# Altium schematic sheet Controls_Microcontroller.SchDoc
size Letter; SheetNumber: 12; SheetTotal: 13
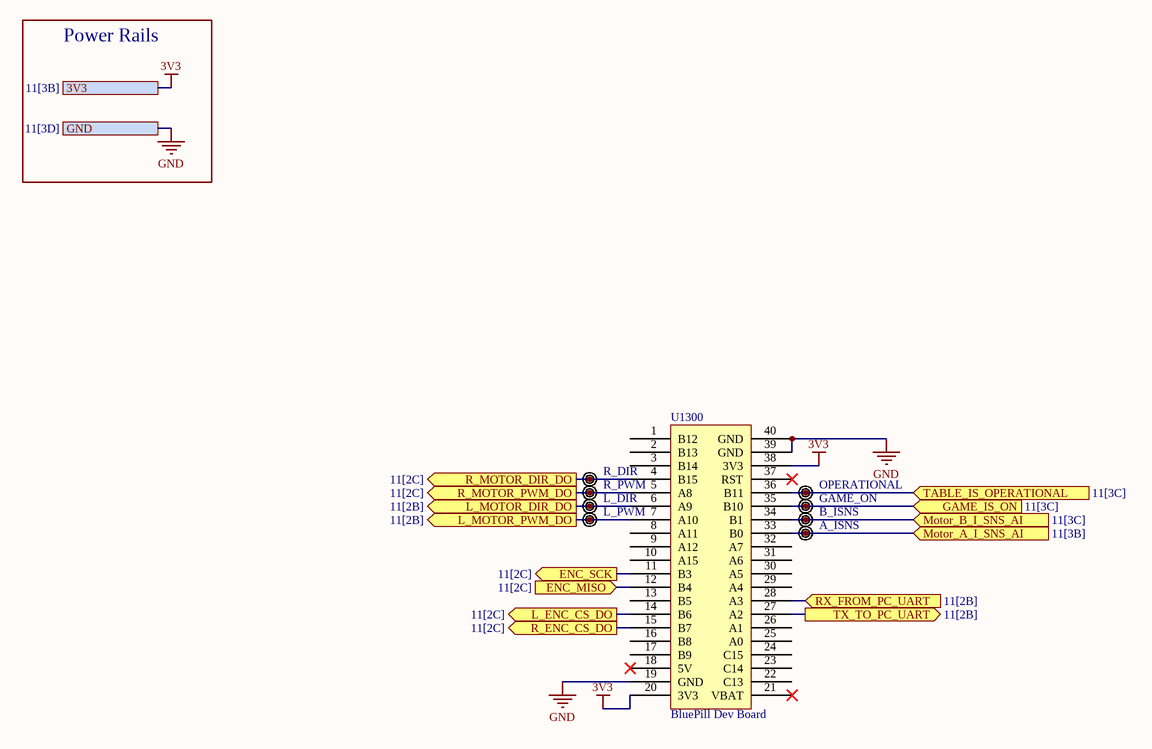
[diagram p0: Controls_Microcontroller.SchDoc]

## Parts
TP1300  R_DIR  [TESTPOINT]  (no BOM)
TP1301  R_PWM  [TESTPOINT]  (no BOM)
TP1302  OPERATIONAL  [TESTPOINT]  (no BOM)
TP1303  L_DIR  [TESTPOINT]  (no BOM)
TP1304  GAME_ON  [TESTPOINT]  (no BOM)
TP1305  L_PWM  [TESTPOINT]  (no BOM)
TP1306  B_ISNS  [TESTPOINT]  (no BOM)
TP1307  A_ISNS  [TESTPOINT]  (no BOM)
U1300  BluePill Dev Board  [Blue Pill]

## Ports
3V3 (see 11[3B]), ENC_MISO (in, see 11[2C]), ENC_SCK (out, see 11[2C]), GAME_IS_ON (in, see 11[3C]), GND (see 11[3D]), L_ENC_CS_DO (out, see 11[2C]), L_MOTOR_DIR_DO (out, see 11[2B]), L_MOTOR_PWM_DO (out, see 11[2B]), Motor_A_I_SNS_AI (in, see 11[3B]), Motor_B_I_SNS_AI (in, see 11[3C]), R_ENC_CS_DO (out, see 11[2C]), R_MOTOR_DIR_DO (out, see 11[2C]), R_MOTOR_PWM_DO (out, see 11[2C]), RX_FROM_PC_UART (in, see 11[2B]), TABLE_IS_OPERATIONAL (in, see 11[3C]), TX_TO_PC_UART (out, see 11[2B])

## Nets
3V3: U1300.20(3V3) U1300.38(3V3) ; port 3V3
GND: U1300.19(GND) U1300.39(GND) U1300.40(GND) ; port GND
ENC_MISO: U1300.12(B4) ; port ENC_MISO
ENC_SCK: U1300.11(B3) ; port ENC_SCK
GAME_IS_ON: TP1304.1(TP) U1300.35(B10) ; port GAME_IS_ON
L_ENC_CS_DO: U1300.14(B6) ; port L_ENC_CS_DO
L_MOTOR_DIR_DO: TP1303.1(TP) U1300.6(A9) ; port L_MOTOR_DIR_DO
L_MOTOR_PWM_DO: TP1305.1(TP) U1300.7(A10) ; port L_MOTOR_PWM_DO
Motor_A_I_SNS_AI: TP1307.1(TP) U1300.33(B0) ; port Motor_A_I_SNS_AI
Motor_B_I_SNS_AI: TP1306.1(TP) U1300.34(B1) ; port Motor_B_I_SNS_AI
R_ENC_CS_DO: U1300.15(B7) ; port R_ENC_CS_DO
R_MOTOR_DIR_DO: TP1300.1(TP) U1300.4(B15) ; port R_MOTOR_DIR_DO
R_MOTOR_PWM_DO: TP1301.1(TP) U1300.5(A8) ; port R_MOTOR_PWM_DO
RX_FROM_PC_UART: U1300.28(A3) ; port RX_FROM_PC_UART
TABLE_IS_OPERATIONAL: TP1302.1(TP) U1300.36(B11) ; port TABLE_IS_OPERATIONAL
TX_TO_PC_UART: U1300.27(A2) ; port TX_TO_PC_UART

Not connected (* = marked no-connect by the designer): U1300 1(B12) 2(B13) 3(B14) 8(A11) 9(A12) 10(A15) 13(B5) 16(B8) 17(B9) 18(5V)* 21(VBAT)* 22(C13) 23(C14) 24(C15) 25(A0) 26(A1) 29(A4) 30(A5) 31(A6) 32(A7) 37(RST)*

## Notes on the sheet
- Power Rails

## Library data of the parts
TP1300-TP1307 = CMP-020-0000-4: Source: UBC Formula Electric.SchLib; Design Item ID: Thru-Hole Test Point